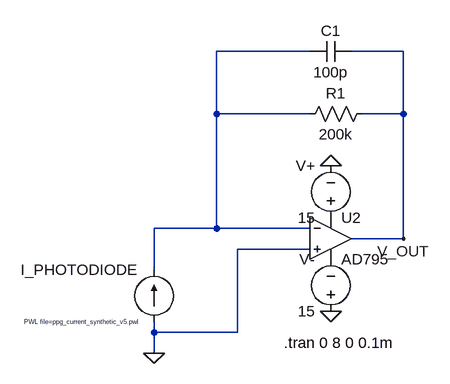
[diagram p0: schematic photodiode_model_TIA.asc]
photodiode_model_TIA.asc, the LTspice schematic file:
Version 4.1
SHEET 1 880 680
WIRE 112 -208 -32 -208
WIRE 256 -208 176 -208
WIRE -32 -112 -32 -208
WIRE 112 -112 -32 -112
WIRE 256 -112 256 -208
WIRE 256 -112 192 -112
WIRE -32 64 -32 -112
WIRE -32 64 -128 64
WIRE 112 64 -32 64
WIRE 256 80 256 -112
WIRE 256 80 176 80
WIRE 112 96 0 96
WIRE -128 128 -128 64
WIRE -128 224 -128 208
WIRE 0 224 0 96
WIRE 0 224 -128 224
WIRE -128 256 -128 224
FLAG -128 256 0
FLAG 144 -32 0
FLAG 144 192 0
FLAG 256 80 V_OUT
SYMBOL current -128 208 R180
WINDOW 0 24 80 Left 2
WINDOW 3 24 0 Left 0
WINDOW 123 0 0 Left 0
WINDOW 39 0 0 Left 0
SYMATTR InstName I_PHOTODIODE
SYMATTR Value PWL file=ppg_current_synthetic_v5.pwl
SYMBOL res 96 -96 R270
WINDOW 0 32 56 VTop 2
WINDOW 3 0 56 VBottom 2
SYMATTR InstName R1
SYMATTR Value 200k
SYMBOL voltage 144 64 R180
WINDOW 0 24 96 Left 2
WINDOW 3 24 16 Left 2
SYMATTR InstName V+
SYMATTR Value 15
SYMBOL voltage 144 208 R180
WINDOW 0 24 96 Left 2
WINDOW 3 24 16 Left 2
SYMATTR InstName V-
SYMATTR Value 15
SYMBOL OpAmps\\AD795 144 16 R0
SYMATTR InstName U2
SYMBOL cap 176 -224 R90
WINDOW 0 0 32 VBottom 2
WINDOW 3 32 32 VTop 2
SYMATTR InstName C1
SYMATTR Value 100p
TEXT 72 240 Left 2 !.tran 0 8 0 0.1m

The netlist it stands for:
* photodiode_model_TIA.asc
I_PHOTODIODE 0 N001 PWL file=ppg_current_synthetic_v5.pwl
R1 N001 V_OUT 200k
V+ P001 0 15
V- 0 P002 15
X§U2 0 N001 P001 P002 V_OUT AD795  ; pins In+ In- V+ V- OUT
C1 V_OUT N001 100p
.tran 0 8 0 0.1m
.lib ADI1.lib
.backanno
.end